# Altium schematic sheet microprocessor.SchDoc
size A4; SheetNumber: 2; SheetTotal: 4
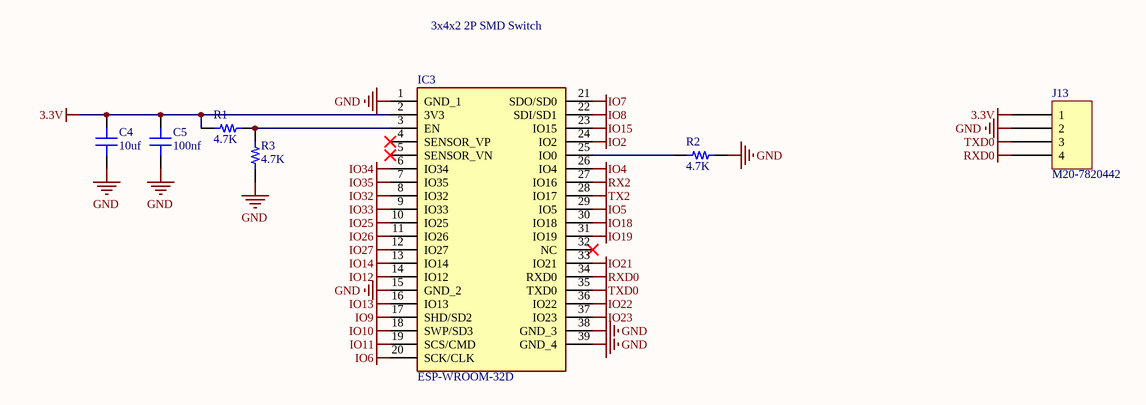
[diagram p0: microprocessor.SchDoc]

## Parts
C4  10uf  [CAP 1206_3216 - 0.8MM]
C5  100nf  [CAP 1206_3216 - 0.8MM]
IC3  ESP-WROOM-32D  [ESPWROOM32D]
J13  M20-7820442  [HARWIN M20-7820445]
R1  4.7K  [RES 1206_3216]
R2  4.7K  [RES 1206_3216]
R3  4.7K  [RES 1206_3216]

## Nets
3.3V: C4.2 C5.2 IC3.2(3V3) J13.1 R1.2
GND: C4.1 C5.1 IC3.1(GND_1) IC3.15(GND_2) IC3.38(GND_3) IC3.39(GND_4) J13.2 R2.1 R3.2
IO2: IC3.24(IO2)
IO4: IC3.26(IO4)
IO5: IC3.29(IO5)
IO6: IC3.20(SCK/CLK)
IO7: IC3.21(SDO/SD0)
IO8: IC3.22(SDI/SD1)
IO9: IC3.17(SHD/SD2)
IO10: IC3.18(SWP/SD3)
IO11: IC3.19(SCS/CMD)
IO12: IC3.14(IO12)
IO13: IC3.16(IO13)
IO14: IC3.13(IO14)
IO15: IC3.23(IO15)
IO18: IC3.30(IO18)
IO19: IC3.31(IO19)
IO21: IC3.33(IO21)
IO22: IC3.36(IO22)
IO23: IC3.37(IO23)
IO25: IC3.10(IO25)
IO26: IC3.11(IO26)
IO27: IC3.12(IO27)
IO32: IC3.8(IO32)
IO33: IC3.9(IO33)
IO34: IC3.6(IO34)
IO35: IC3.7(IO35)
RX2: IC3.27(IO16)
RXD0: IC3.34(RXD0) J13.4
TX2: IC3.28(IO17)
TXD0: IC3.35(TXD0) J13.3
NetIC3_3: IC3.3(EN) R1.1 R3.1
NetIC3_25: IC3.25(IO0) R2.2

Not connected (* = marked no-connect by the designer): IC3 4(SENSOR_VP)* 5(SENSOR_VN)* 32(NC)*

## Notes on the sheet
- 3x4x2 2P SMD Switch

## Library data of the parts
C4 C5 = MM062C102KCZ2A: CAP CER 1000PF 200V X7R 1206; manufacturer: AVX Corporation; Tolerance: ±10%; Part Number: MM062C102KCZ2A; Value: 1000pF; Applications: Medical, Non-Critical; Capacitance: 1000pF; componentlink1description: Datasheet; componentlink1url: http://datasheets.avx.com/AVX-MM.pdf; componentlink2description: DigiKey Link; componentlink2url: http://digikey.com/product-detail/en/avx-corporation/MM062C102KCZ2A/478-10625-1-ND/7344886; Device Package: 1206 (3216 Metric); lastupdated: 2.09.2020 01:04:46; Lifecycle Status: Active; Minimum Order: 1; Mounting Type: Surface Mount, MLCC; Operating Temperature: -55°C ~ 125°C; Package / Case: 1206 (3216 Metric); packaging: TapeAndReel; partid: 18686; Part Status: Active; price: 0.57; series: MM; Size / Dimension: 0.126" L x 0.063" W (3.20mm x 1.60mm); Supplier 1: DigiKey; Supplier Part Number 1: 478-10625-1-ND; Temperature Coefficient: X7R; Thickness (Max): 0.029" (0.74mm); Voltage - Rated: 200V
IC3 = ESP-WROOM-32D: Integrated Circuit; Manufacturer_Name: Espressif Systems; Datasheet Link: https://componentsearchengine.com/Datasheets/1/ESP-WROOM-32D.pdf; Height: 3.2mm; Manufacturer_Part_Number: ESP-WROOM-32D; Mouser Part Number: 356-ESP-WROOM-32D; Mouser Price/Stock: https://www.mouser.co.uk/ProductDetail/Espressif-Systems/ESP-WROOM-32D?qs=MLItCLRbWsyWVKgdQMcFuQ%3D%3D
J13 = M20-7820442: CONN RCPT 4POS 0.1 GOLD PCB; Manufacturer: Harwin Inc.; Connector Type: Receptacle; Contact Length - Post: 0.118" (3.00mm); Current Rating (Amps): 3A; Mated Stacking Heights: 11.04mm, 12.63mm; Material Flammability Rating: UL94 V-0; Number of Positions: 4; Number of Positions Loaded: All; Pitch - Mating: 0.100" (2.54mm); Style: Board to Board or Cable; Part Number: M20-7820442; ComponentLink1Description: Datasheet; ComponentLink1URL: https://cdn.harwin.com/pdfs/Harwin_PC_Connectors_M20.pdf; ComponentLink2Description: DigiKey Link; ComponentLink2URL: https://www.digikey.com/en/products/detail/harwin-inc/M20-7820442/3727760; Contact Finish - Mating: Gold; Contact Finish - Post: Tin; Contact Finish Thickness - Mating: Flash; Contact Type: Female Socket; Fastening Type: Push-Pull; Insulation Color: Black; Insulation Height: 0.335" (8.51mm); LastUpdated: 21.09.2022 18:57:11; Lifecycle Status: Active; Minimum Order: 1; Mounting Type: Through Hole; Number of Rows: 1; Operating Temperature: -40°C ~ 105°C; Packaging: Tube; Part Status: Active; Price: 0.45; Series: M20; Supplier 1: DigiKey; Supplier Part Number 1: 952-1791-ND; Termination: Solder
R1-R3 = CRCW120661K9FKEA: RES SMD 61.9K OHM 1% 1/4W 1206; Manufacturer: Vishay Dale; Power (Watts): 0.25W, 1/4W; Resistance: 61.9 kOhms; Temperature Coefficient: ±100ppm/°C; Value: 61.9 kOhms; Part Number: CRCW120661K9FKEA; ComponentLink1Description: Datasheet; ComponentLink1URL: http://www.vishay.com/docs/20035/dcrcwe3.pdf; ComponentLink2Description: DigiKey Link; ComponentLink2URL: https://www.digikey.com/en/products/detail/vishay-dale/CRCW120661K9FKEA/1176848; Composition: Thick Film; Device Package: 1206 (3216 Metric); Features: Automotive AEC-Q200; Height - Seated (Max): 0.024" (0.60mm); LastUpdated: 9.02.2024 20:54:45; Lifecycle Status: Active; Minimum Order: 1; Number of Terminations: 2; Operating Temperature: -55°C ~ 155°C; Package / Case: 1206 (3216 Metric); Packaging: TapeAndReel; PartId: 26923; Part Status: Active; Price: 0.01; Ratings: AEC-Q200; Series: CRCW; Size / Dimension: 0.126" L x 0.063" W (3.20mm x 1.60mm); Supplier 1: DigiKey; Supplier Part Number 1: 541-61.9KFCT-ND; Supplier Device Package: 1206; Tolerance: ±1%